# Altium schematic sheet STM32H743_原理图.SchDoc
size 457 x 317 mm
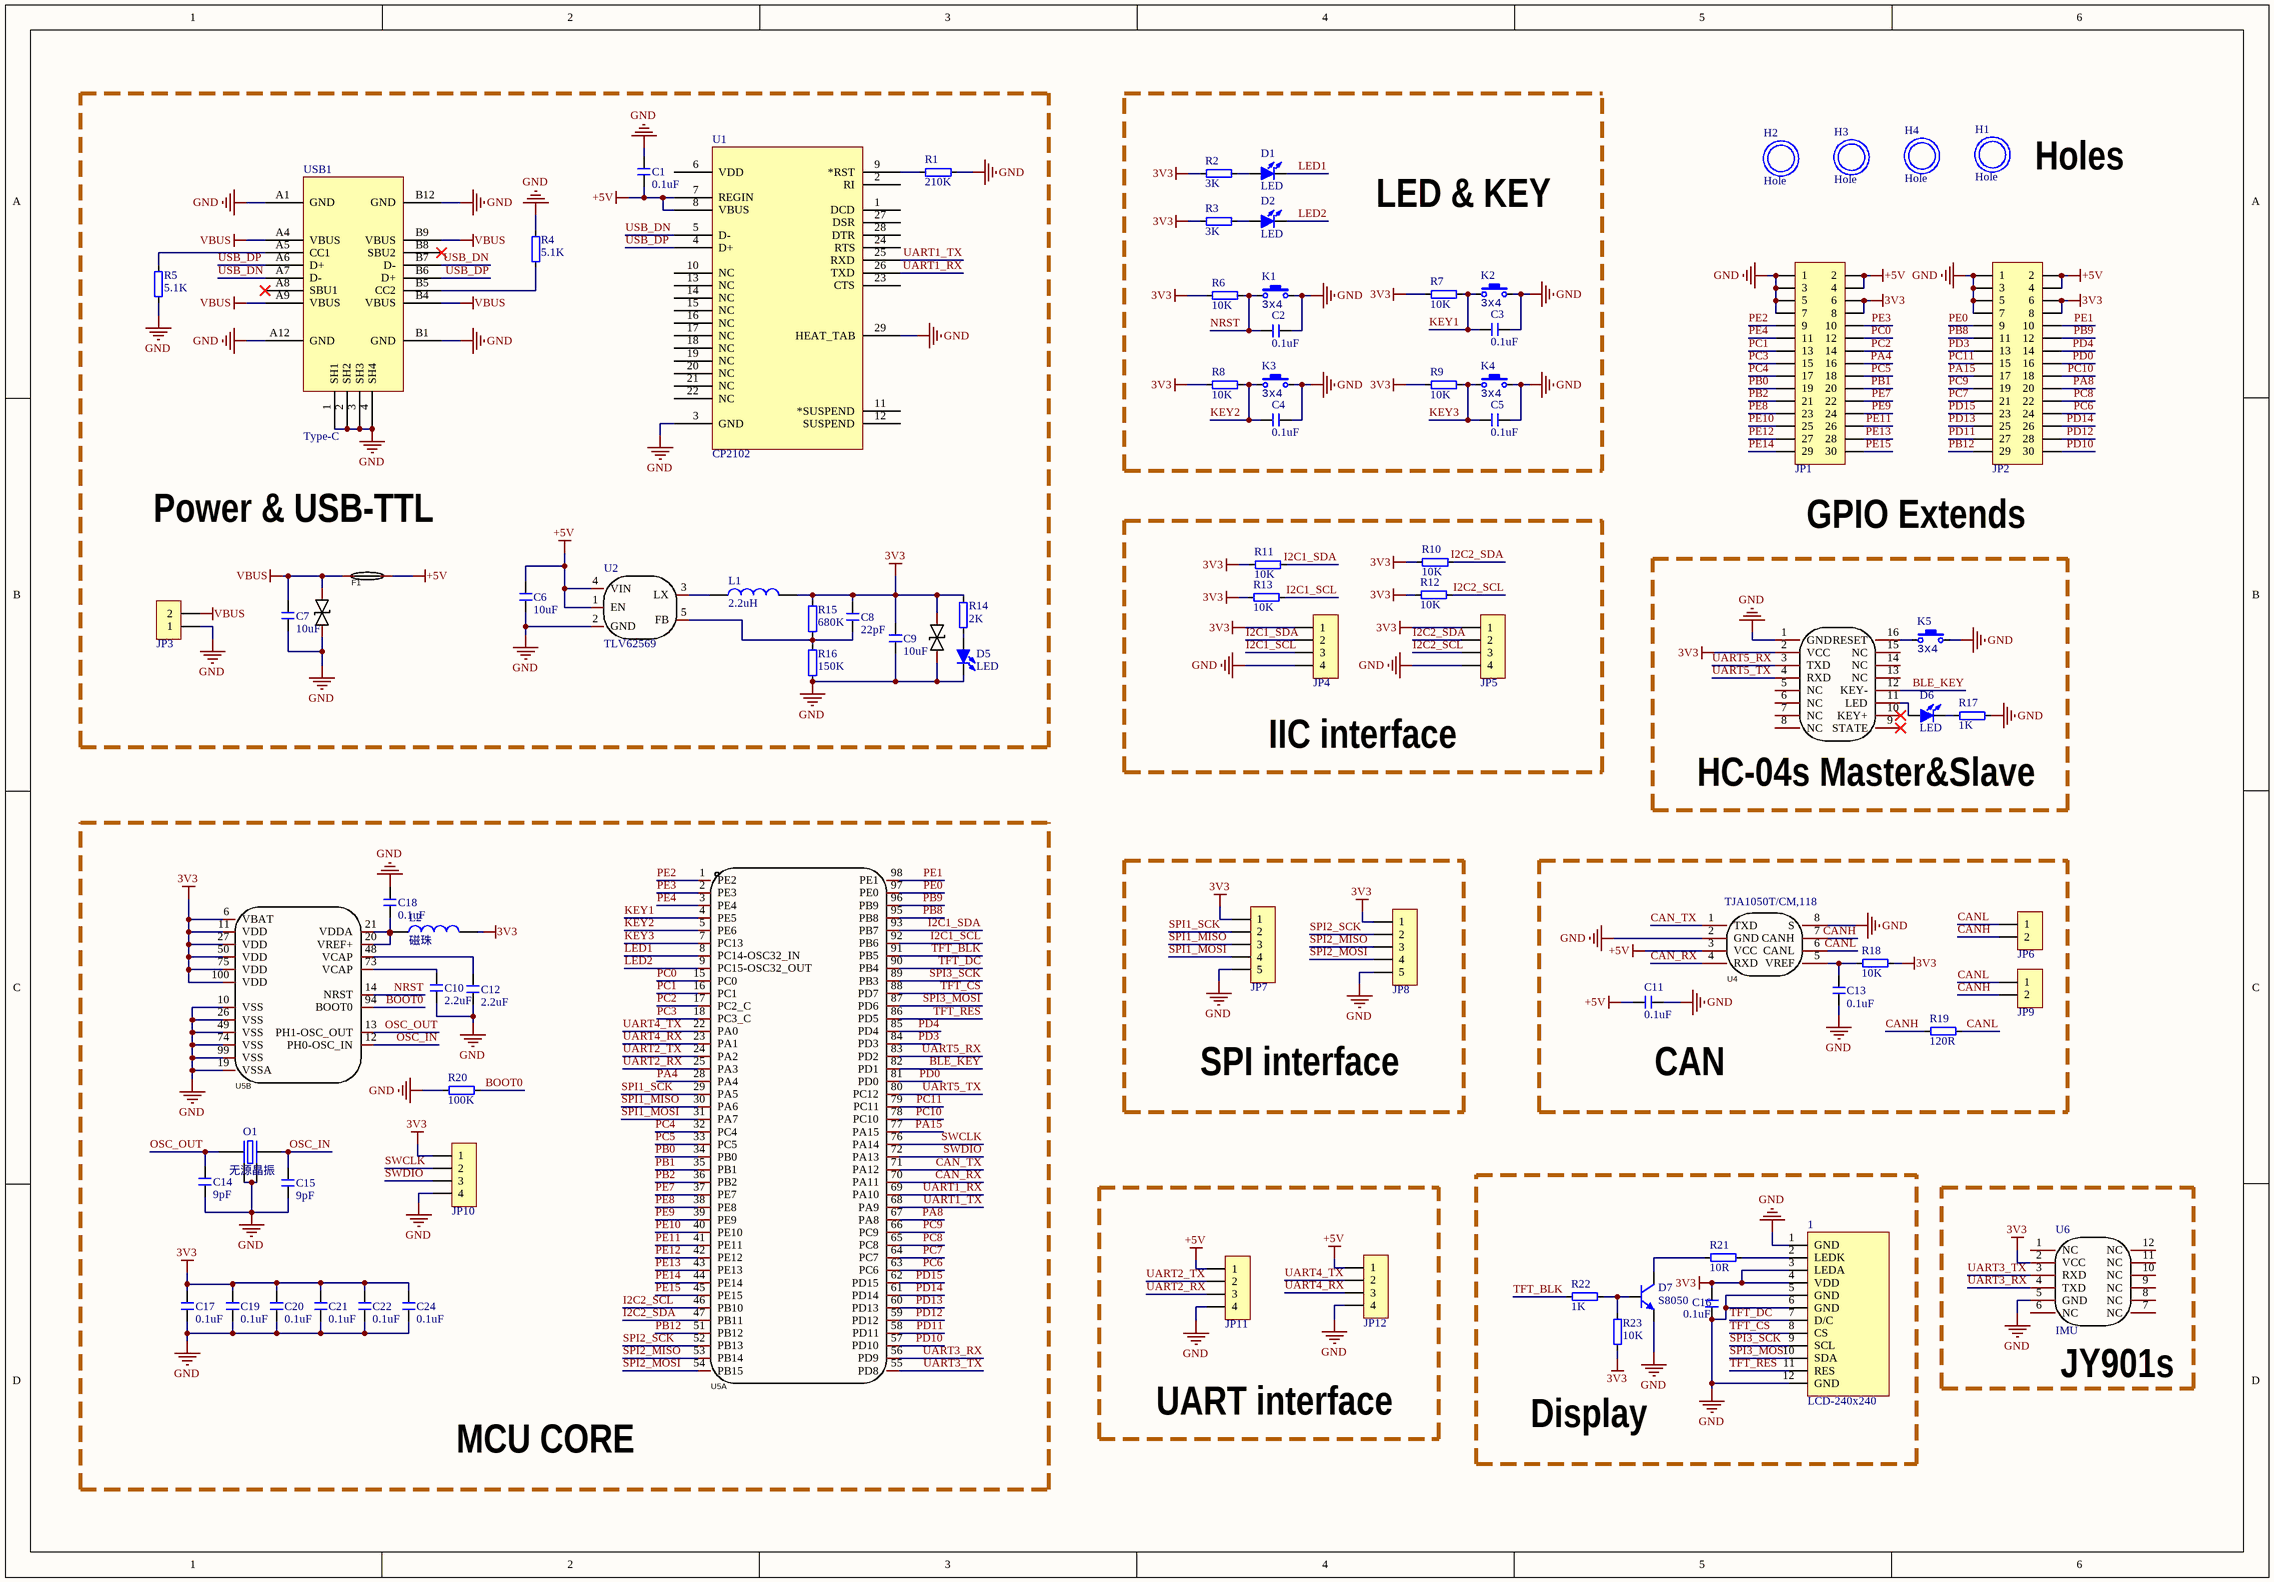
[diagram p0: STM32H743_原理图.SchDoc]

## Parts
1  LCD-240x240  [LCD-240x240-NoHole]
C1  0.1uF  [CAP_0402]
C2  0.1uF  [CAP_0402]
C3  0.1uF  [CAP_0402]
C4  0.1uF  [CAP_0402]
C5  0.1uF  [CAP_0402]
C6  10uF  [CAP_0402]
C7  10uF  [CAP_0402]
C8  22pF  [CAP_0402]
C9  10uF  [CAP_0402]
C10  2.2uF  [CAP_0402]
C11  0.1uF  [CAP_0402]
C12  2.2uF  [CAP_0402]
C13  0.1uF  [CAP_0402]
C14  9pF  [CAP_0402]
C15  9pF  [CAP_0402]
C16  0.1uF  [CAP_0402]
C17  0.1uF  [CAP_0402]
C18  0.1uF  [CAP_0402]
C19  0.1uF  [CAP_0402]
C20  0.1uF  [CAP_0402]
C21  0.1uF  [CAP_0402]
C22  0.1uF  [CAP_0402]
C24  0.1uF  [CAP_0402]
D1  LED  [LED_0402_RED]
D2  LED  [LED_0402_RED]
D3  LESD3Z5.0CMT1G  [SOD-323]  (value not drawn)
D4  LESD3Z5.0CMT1G  [SOD-323]  (value not drawn)
D5  LED  [LED_0402_RED]
D6  LED  [LED_0402_RED]
D7  S8050  [SOT23-3L]
F1  S0603-F-2.0A  [R 0603]  (value not drawn)
H1  Hole  [Hole]
H2  Hole  [Hole]
H3  Hole  [Hole]
H4  Hole  [Hole]
JP1  Header 2X11  [HDR2.54-LI-2x15P]  (value not drawn)
JP2  Header 2X11  [HDR2.54-LI-2x15P]  (value not drawn)
JP3  HDR-1X2  [HDR2.54-LI-2P]  (value not drawn)
JP4  HDR-1X4  [MX 1.25-WS-4P]  (value not drawn)
JP5  HDR-1X4  [MX 1.25-WS-4P]  (value not drawn)
JP6  HDR-1X2  [GH1.25-WT-2P]  (value not drawn)
JP7  HDR-1X5  [MX 1.25-WS-5P]  (value not drawn)
JP8  HDR-1X5  [MX 1.25-WS-5P]  (value not drawn)
JP9  HDR-1X2  [GH1.25-WT-2P]  (value not drawn)
JP10  HDR-1X4  [MX 1.25-WS-4P]  (value not drawn)
JP11  HDR-1X4  [MX 1.25-WS-4P]  (value not drawn)
JP12  HDR-1X4  [MX 1.25-WS-4P]  (value not drawn)
K1  value 3x4  [KEY]  (hidden comment: TACT 2P)
K2  value 3x4  [KEY]  (hidden comment: TACT 2P)
K3  value 3x4  [KEY]  (hidden comment: TACT 2P)
K4  value 3x4  [KEY]  (hidden comment: TACT 2P)
K5  value 3x4  [KEY]  (hidden comment: TACT 2P)
L1  2.2uH  [2520-L]
L2  磁珠  [L 0603]
O1  无源晶振  [OSC 3225-4P]
R1  210K  [RES_0402]
R2  3K  [RES_0402]
R3  3K  [RES_0402]
R4  5.1K  [RES_0402]
R5  5.1K  [RES_0402]
R6  10K  [RES_0402]
R7  10K  [RES_0402]
R8  10K  [RES_0402]
R9  10K  [RES_0402]
R10  10K  [RES_0402]
R11  10K  [RES_0402]
R12  10K  [RES_0402]
R13  10K  [RES_0402]
R14  2K  [RES_0402]
R15  680K  [RES_0402]
R16  150K  [RES_0402]
R17  1K  [RES_0402]
R18  10K  [RES_0402]
R19  120R  [RES_0402]
R20  100K  [RES_0402]
R21  10R  [RES_0402]
R22  1K  [RES_0402]
R23  10K  [RES_0402]
U1  CP2102  [QFN-28]
U2  TLV62569  [SOT23-5N]
U3  TJA1050T/CM,118  [HC-04-S]  (value not drawn)
U4  TJA1050T/CM,118  [SOP8]
U5  STM32H743VIT6_C114409  [LQFP100-14*14]  (value not drawn)  (parts A,B of 2)
U6  IMU  [IMU]
USB1  Type-C  [Type-C-TOP]

## Blocks framed on the sheet
Power & USB-TTL: C1 C6-C9 D3-D5 F1 JP3 L1 R1 R4 R5 R14-R16 U1 U2 USB1
LED & KEY: C2-C5 D1 D2 K1-K4 R2 R3 R6-R9
IIC interface: JP4 JP5 R10-R13
HC-04s Master&Slave: D6 K5 R17 U3
MCU CORE: C10 C12 C14 C15 C17-C22 C24 JP10 L2 O1 R20 U5
SPI interface: JP7 JP8
CAN: C11 C13 JP6 JP9 R18 R19 U4
UART interface: JP11 JP12
Display: 1 C16 D7 R21-R23
JY901s: U6

## Nets
3V3: 1.3(LEDA) 1.4(VDD) C8.2 C9.2 C16.1 C17.2 C19.2 C20.2 C21.2 C22.2 C24.2 D4.2 JP1.6 JP1.8 JP2.6 JP2.8 JP4.1 JP5.1 JP7.1 JP8.1 JP10.1 L1.2 L2.2 R2.2 R3.2 R6.2 R7.2 R8.2 R9.2 R10.2 R11.2 R12.2 R13.2 R14.2 R15.2 R18.1 R23.2 U3.2(VCC) U5.6(VBAT) U5.11(VDD) U5.27(VDD) U5.50(VDD) U5.75(VDD) U5.100(VDD) U6.2(VCC)
+5V: C1.1 C6.2 C11.2 F1.2 JP1.2 JP1.4 JP2.2 JP2.4 JP11.1 JP12.1 U1.7(REGIN) U1.8(VBUS) U2.1(EN) U2.4(VIN) U4.3(VCC)
GND: 1.1(GND) 1.5(GND) 1.6(GND) 1.12(GND) C1.2 C2.1 C3.1 C4.1 C5.1 C6.1 C7.1 C9.1 C10.1 C11.1 C12.1 C13.2 C14.1 C15.1 C16.2 C17.1 C18.2 C19.1 C20.1 C21.1 C22.1 C24.1 D3.1 D4.1 D5.2(K) D7.2(E) JP1.1 JP1.3 JP1.5 JP1.7 JP2.1 JP2.3 JP2.5 JP2.7 JP3.1 JP4.4 JP5.4 JP7.5 JP8.5 JP10.4 JP11.4 JP12.4 K1.2 K2.2 K3.2 K4.2 K5.2 O1.2 O1.4 R1.2 R4.1 R5.1 R16.1 R17.1 R20.2 U1.3(GND) U1.29(HEAT_TAB) U2.2(GND) U3.1(GND) U4.2(GND) U4.8(S) U5.10(VSS) U5.19(VSSA) U5.26(VSS) U5.49(VSS) U5.74(VSS) U5.99(VSS) U6.5(GND) USB1.1(SH1) USB1.2(SH2) USB1.3(SH3) USB1.4(SH4) USB1.A1(GND) USB1.A12(GND) USB1.B1(GND) USB1.B12(GND)
VBUS: C7.2 D3.2 F1.1 JP3.2 USB1.A4(VBUS) USB1.A9(VBUS) USB1.B4(VBUS) USB1.B9(VBUS)
BLE_KEY: U3.12(KEY-) U5.82(PD1)
BOOT0: R20.1 U5.94(BOOT0)
CAN_RX: U4.4(RXD) U5.70(PA11)
CAN_TX: U4.1(TXD) U5.71(PA12)
CANH: JP6.2 JP9.2 R19.2 U4.7(CANH)
CANL: JP6.1 JP9.1 R19.1 U4.6(CANL)
I2C1_SCL: JP4.3 R13.1 U5.92(PB6)
I2C1_SDA: JP4.2 R11.1 U5.93(PB7)
I2C2_SCL: JP5.3 R12.1 U5.46(PB10)
I2C2_SDA: JP5.2 R10.1 U5.47(PB11)
KEY1: C3.2 K2.1 R7.1 U5.4(PE5)
KEY2: C4.2 K3.1 R8.1 U5.5(PE6)
KEY3: C5.2 K4.1 R9.1 U5.7(PC13)
LED1: D1.2(K) U5.8(PC14-OSC32_IN)
LED2: D2.2(K) U5.9(PC15-OSC32_OUT)
NRST: C2.2 K1.1 R6.1 U5.14(NRST)
OSC_IN: C15.2 O1.3 U5.12(PH0-OSC_IN)
OSC_OUT: C14.2 O1.1 U5.13(PH1-OSC_OUT)
PA4: JP1.16 U5.28(PA4)
PA8: JP2.20 U5.67(PA8)
PA15: JP2.17 U5.77(PA15)
PB0: JP1.19 U5.34(PB0)
PB1: JP1.20 U5.35(PB1)
PB2: JP1.21 U5.36(PB2)
PB8: JP2.11 U5.95(PB8)
PB9: JP2.12 U5.96(PB9)
PB12: JP2.29 U5.51(PB12)
PC0: JP1.12 U5.15(PC0)
PC1: JP1.13 U5.16(PC1)
PC2: JP1.14 U5.17(PC2_C)
PC3: JP1.15 U5.18(PC3_C)
PC4: JP1.17 U5.32(PC4)
PC5: JP1.18 U5.33(PC5)
PC6: JP2.24 U5.63(PC6)
PC7: JP2.21 U5.64(PC7)
PC8: JP2.22 U5.65(PC8)
PC9: JP2.19 U5.66(PC9)
PC10: JP2.18 U5.78(PC10)
PC11: JP2.15 U5.79(PC11)
PD0: JP2.16 U5.81(PD0)
PD3: JP2.13 U5.84(PD3)
PD4: JP2.14 U5.85(PD4)
PD10: JP2.30 U5.57(PD10)
PD11: JP2.27 U5.58(PD11)
PD12: JP2.28 U5.59(PD12)
PD13: JP2.25 U5.60(PD13)
PD14: JP2.26 U5.61(PD14)
PD15: JP2.23 U5.62(PD15)
PE0: JP2.9 U5.97(PE0)
PE1: JP2.10 U5.98(PE1)
PE2: JP1.9 U5.1(PE2)
PE3: JP1.10 U5.2(PE3)
PE4: JP1.11 U5.3(PE4)
PE7: JP1.22 U5.37(PE7)
PE8: JP1.23 U5.38(PE8)
PE9: JP1.24 U5.39(PE9)
PE10: JP1.25 U5.40(PE10)
PE11: JP1.26 U5.41(PE11)
PE12: JP1.27 U5.42(PE12)
PE13: JP1.28 U5.43(PE13)
PE14: JP1.29 U5.44(PE14)
PE15: JP1.30 U5.45(PE15)
SPI1_MISO: JP7.3 U5.30(PA6)
SPI1_MOSI: JP7.4 U5.31(PA7)
SPI1_SCK: JP7.2 U5.29(PA5)
SPI2_MISO: JP8.3 U5.53(PB14)
SPI2_MOSI: JP8.4 U5.54(PB15)
SPI2_SCK: JP8.2 U5.52(PB13)
SPI3_MOSI: 1.10(SDA) U5.87(PD6)
SPI3_SCK: 1.9(SCL) U5.89(PB3)
SWCLK: JP10.2 U5.76(PA14)
SWDIO: JP10.3 U5.72(PA13)
TFT_BLK: R22.2 U5.91(PB5)
TFT_CS: 1.8(CS) U5.88(PD7)
TFT_DC: 1.7(D/C) U5.90(PB4)
TFT_RES: 1.11(RES) U5.86(PD5)
UART1_RX: U1.26(TXD) U5.69(PA10)
UART1_TX: U1.25(RXD) U5.68(PA9)
UART2_RX: JP11.3 U5.25(PA3)
UART2_TX: JP11.2 U5.24(PA2)
UART3_RX: U5.56(PD9) U6.4(TXD)
UART3_TX: U5.55(PD8) U6.3(RXD)
UART4_RX: JP12.3 U5.23(PA1)
UART4_TX: JP12.2 U5.22(PA0)
UART5_RX: U3.3(TXD) U5.83(PD2)
UART5_TX: U3.4(RXD) U5.80(PC12)
USB_DN: U1.5(D-) USB1.A7(D-) USB1.B7(D-)
USB_DP: U1.4(D+) USB1.A6(D+) USB1.B6(D+)
Net1_2: 1.2(LEDK) R21.1
NetC8_1: C8.1 R15.1 R16.2 U2.5(FB)
NetC10_2: C10.2 U5.73(VCAP)
NetC12_2: C12.2 U5.48(VCAP)
NetC13_1: C13.1 R18.2 U4.5(VREF)
NetC18_1: C18.1 L2.1 U5.20(VREF+) U5.21(VDDA)
NetD1_1: D1.1(A) R2.1
NetD2_1: D2.1(A) R3.1
NetD5_1: D5.1(A) R14.1
NetD6_1: D6.1(A) U3.11(LED)
NetD6_2: D6.2(K) R17.2
NetD7_1: D7.1(B) R22.1 R23.1
NetD7_3: D7.3(C) R21.2
NetK5_1: K5.1 U3.16(RESET)
NetL1_1: L1.1 U2.3(LX)
NetR1_1: R1.1 U1.9(*RST)
NetR4_2: R4.2 USB1.B5(CC2)
NetR5_2: R5.2 USB1.A5(CC1)

Not connected (* = marked no-connect by the designer): U1 1(DCD) 2(RI) 6(VDD) 10(NC) 11(*SUSPEND) 12(SUSPEND) 13(NC) 14(NC) 15(NC) 16(NC) 17(NC) 18(NC) 19(NC) 20(NC) 21(NC) 22(NC) 23(CTS) 24(RTS) 27(DSR) 28(DTR); U3 5(NC) 6(NC) 7(NC) 8(NC) 9(STATE)* 10(KEY+)* 13(NC) 14(NC) 15(NC); U6 1(NC) 6(NC) 7(NC) 8(NC) 9(NC) 10(NC) 11(NC) 12(NC); USB1 A8(SBU1)* B8(SBU2)*

## Notes on the sheet
- Holes
- GPIO Extends

## Library data of the parts
1 = LCD-240x240: 显示屏
C1-C22 C24 = Capacitor
D3 D4 = LESD3Z5.0CMT1G: Manufacturer: LRC(乐山无线电); Add into BOM: yes; Name: LESD3Z5.0CMT1G; Symbol: LESD3Z5.0CMT1G; Device: LESD3Z5.0CMT1G; LCSC Part Name: LESD3Z5.0CMT1G; Supplier Part: C172405; Manufacturer Part: LESD3Z5.0CMT1G; Supplier Footprint: SOD-323; JLCPCB Part Class: Extended Part; Datasheet: https://atta.szlcsc.com/upload/public/pdf/source/20180130/C172405_15172974194641323435.pdf; Supplier: LCSC; Convert to PCB: yes
D7 = 三极管-NPN
F1 = S0603-F-2.0A: Manufacturer: SART(萨特); Add into BOM: yes; Type: 贴片式陶瓷保险丝; Current Rating: 2A; Voltage Rating (DC): 32V; Breaking Capacity: 50A; Name: S0603-F-2.0A; Symbol: S0603-F-2.0A; Device: S0603-F-2.0A; LCSC Part Name: S0603-F-2.0A; Supplier Part: C553908; Manufacturer Part: S0603-F-2.0A; Supplier Footprint: 0603; JLCPCB Part Class: Extended Part; Datasheet: https://atta.szlcsc.com/upload/public/pdf/source/20200518/C553908_4D61F2393DF2DB676B920346B02237E6.pdf; Supplier: LCSC; Convert to PCB: yes; Operating Temperature: -55℃~+125℃
JP1 JP2 = Header 15X2: 15*2P接插件; 版权归属: 源创客; BOM名称: 15*2P接插件; 学习资源: www.ooocke.com
JP3 JP6 JP9 = Header 2: 2P接插件; 版权归属: 源创客; BOM名称: 2P接插件; 学习资源: www.ooocke.com
JP4 JP5 JP10-JP12 = Header 4: 4P接插件; 版权归属: 源创客; BOM名称: 4P接插件; 学习资源: www.ooocke.com
JP7 JP8 = Header 5: 5P接插件; 版权归属: 源创客; BOM名称: 5P接插件; 学习资源: www.ooocke.com
K1-K5 = ButtonTACT_3x4x2_180: Button; type: TACT 2P
L1 L2 = Inductance
R1-R23 = Resistor
U1 = CP2102: USB转TTL; PART DESC: SINGLE-CHIP USB TO UART BRIDGE, QFN28, RoHS.; MFG #1: SILICON LABS; PART NUMBER: CP2102; Value: Value; RefDes: RefDes; Type: DEV
U3 = HC-04-S: Manufacturer: NXP(恩智浦); Add into BOM: yes; Supply Voltage: 4.75V~5.25V; Supply Current: 50mA; Name: TJA1050T/CM,118; Symbol: TJA1050T/CM,118; Device: TJA1050T/CM,118; LCSC Part Name: 4.75V~5.25V; Supplier Part: C6952; Manufacturer Part: TJA1050T/CM,118; Supplier Footprint: SOIC-8; JLCPCB Part Class: Basic Part; Datasheet: https://atta.szlcsc.com/upload/public/pdf/source/20140411/1457707042917.pdf; Supplier: LCSC; Convert to PCB: yes; Type: 收发器
U4 = TJA1050T/CM,118: Manufacturer: NXP(恩智浦); Add into BOM: yes; Supply Voltage: 4.75V~5.25V; Supply Current: 50mA; Name: TJA1050T/CM,118; Symbol: TJA1050T/CM,118; Device: TJA1050T/CM,118; LCSC Part Name: 4.75V~5.25V; Supplier Part: C6952; Manufacturer Part: TJA1050T/CM,118; Supplier Footprint: SOIC-8; JLCPCB Part Class: Basic Part; Datasheet: https://atta.szlcsc.com/upload/public/pdf/source/20140411/1457707042917.pdf; Supplier: LCSC; Convert to PCB: yes; Type: 收发器
U5 = STM32H743VIT6_C114409: Manufacturer: ST(意法半导体); Add into BOM: yes; CPU Maximum Speed: 480MHz; Operating Voltage Range: 1.71V~3.6V; Program Storage Size: 2MB; GPIO Ports Number: 82; ADC (Bit): 16bit; DAC (Bit): 12bit; Universal Serial Bus: 有; Name: STM32H743VIT6; Symbol: STM32H743VIT6_C114409; Device: STM32H743VIT6_C114409; LCSC Part Name: 480MHz; Supplier Part: C114409; Manufacturer Part: STM32H743VIT6; Supplier Footprint: LQFP-100(14x14); JLCPCB Part Class: Extended Part; Datasheet: https://atta.szlcsc.com/upload/public/pdf/source/20200508/C529058_DA70143F266D6D825C3A912656F12A87.pdf; Supplier: LCSC; Convert to PCB: yes; Watchdog: 有; Infrared Data Association: 有; Low-Voltage Detect: 有; LCD Module: 有; Secure Digital Input and Output: 有; Direct Memory Access: 有; Internal Oscillator: 有; Operating Temperature Range: -40℃~+85℃
USB1 = USB-Type-C-TOP